# EAGLE design arduino modular pcb (EAGLE 9.6.2)
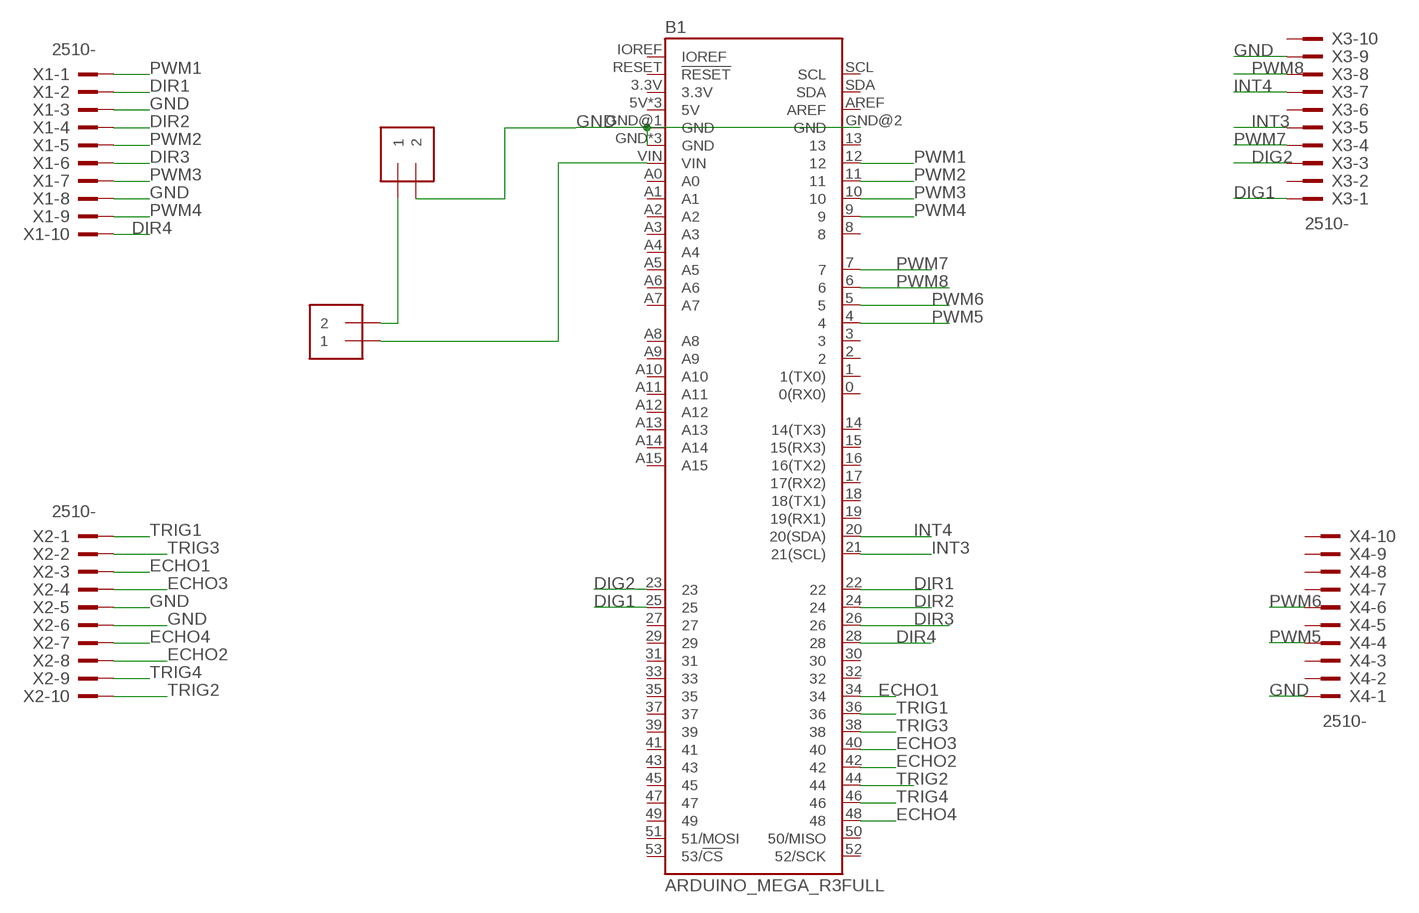
[diagram p0: schematic, sheet 1]

## Parts
B1  ARDUINO_MEGA_R3FULL  [ARDUINO_MEGA_NO_SILK]
J1  1X2-3.5MM  [1X2-3.5MM]
J2  1X2-3.5MM  [1X2-3.5MM]
X1  2510-  [PAK100/2500-10]
X2  2510-  [PAK100/2500-10]
X3  2510-  [PAK100/2500-10]
X4  2510-  [PAK100/2500-10]

## Nets
DIG1: B1.25 X3.1
DIG2: B1.23 X3.3
DIR1: B1.22 X1.2
DIR2: B1.24 X1.4
DIR3: B1.26 X1.6
DIR4: B1.28 X1.10
ECHO1: B1.34 X2.3
ECHO2: B1.42 X2.8
ECHO3: B1.40 X2.4
ECHO4: B1.48 X2.7
GND: B1.GND B1.GND@1(GND) B1.GND@2(GND) B1.GND@3(GND) B1.GND@4(GND) J2.2 X1.3 X1.8 X2.5 X2.6 X3.9 X4.1
INT3: B1.21(21(SCL)) X3.5
INT4: B1.20(20(SDA)) X3.7
N$1: J1.2 J2.1
N$3: B1.VIN J1.1
PWM1: B1.12 X1.1
PWM2: B1.11 X1.5
PWM3: B1.10 X1.7
PWM4: B1.9 X1.9
PWM5: B1.4 X4.4
PWM6: B1.5 X4.6
PWM7: B1.7 X3.4
PWM8: B1.6 X3.8
TRIG1: B1.36 X2.1
TRIG2: B1.44 X2.10
TRIG3: B1.38 X2.2
TRIG4: B1.46 X2.9
Unconnected: B1.0(0(RX0)) B1.1(1(TX0)) B1.2 B1.3 B1.3.3V B1.5V B1.5V@1(5V) B1.5V@2(5V) B1.8 B1.13 B1.14(14(TX3)) B1.15(15(RX3)) B1.16(16(TX2)) B1.17(17(RX2)) B1.18(18(TX1)) B1.19(19(RX1)) B1.27 B1.29 B1.30 B1.31 B1.32 B1.33 B1.35 B1.37 B1.39 B1.41 B1.43 B1.45 B1.47 B1.49 B1.50(50/MISO) B1.51(51/MOSI) B1.52(52/SCK) B1.53(53/!CS) B1.A0 B1.A1 B1.A2 B1.A3 B1.A4 B1.A5 B1.A6 B1.A7 B1.A8 B1.A9 B1.A10 B1.A11 B1.A12 B1.A13 B1.A14 B1.A15 B1.AREF B1.IOREF B1.RESET(!RESET) B1.SCL B1.SDA X3.2 X3.6 X3.10 X4.2 X4.3 X4.5 X4.7 X4.8 X4.9 X4.10

## Library data of the parts
B1 = SparkFun-Boards:ARDUINO_MEGA_R3: Arduino Mega R3 ATmega2560 R3 compatible footprint. SparkFun Products: Arduino Mega 2560 R3 <https://www.sparkfun.com/products/11061>
J1 J2 = adafruit:1X2: 3.5mm Terminal block http://www.ladyada.net/library/pcb/eaglelibrary.html
X1-X4 = con-3m:2510-: 3M (TM) Pak 100 4-Wall Header Source: 3M; MF: 3M; MPN: 2510-6002UB; OC_FARNELL: 9838244; OC_NEWARK: 46F4725

## Board
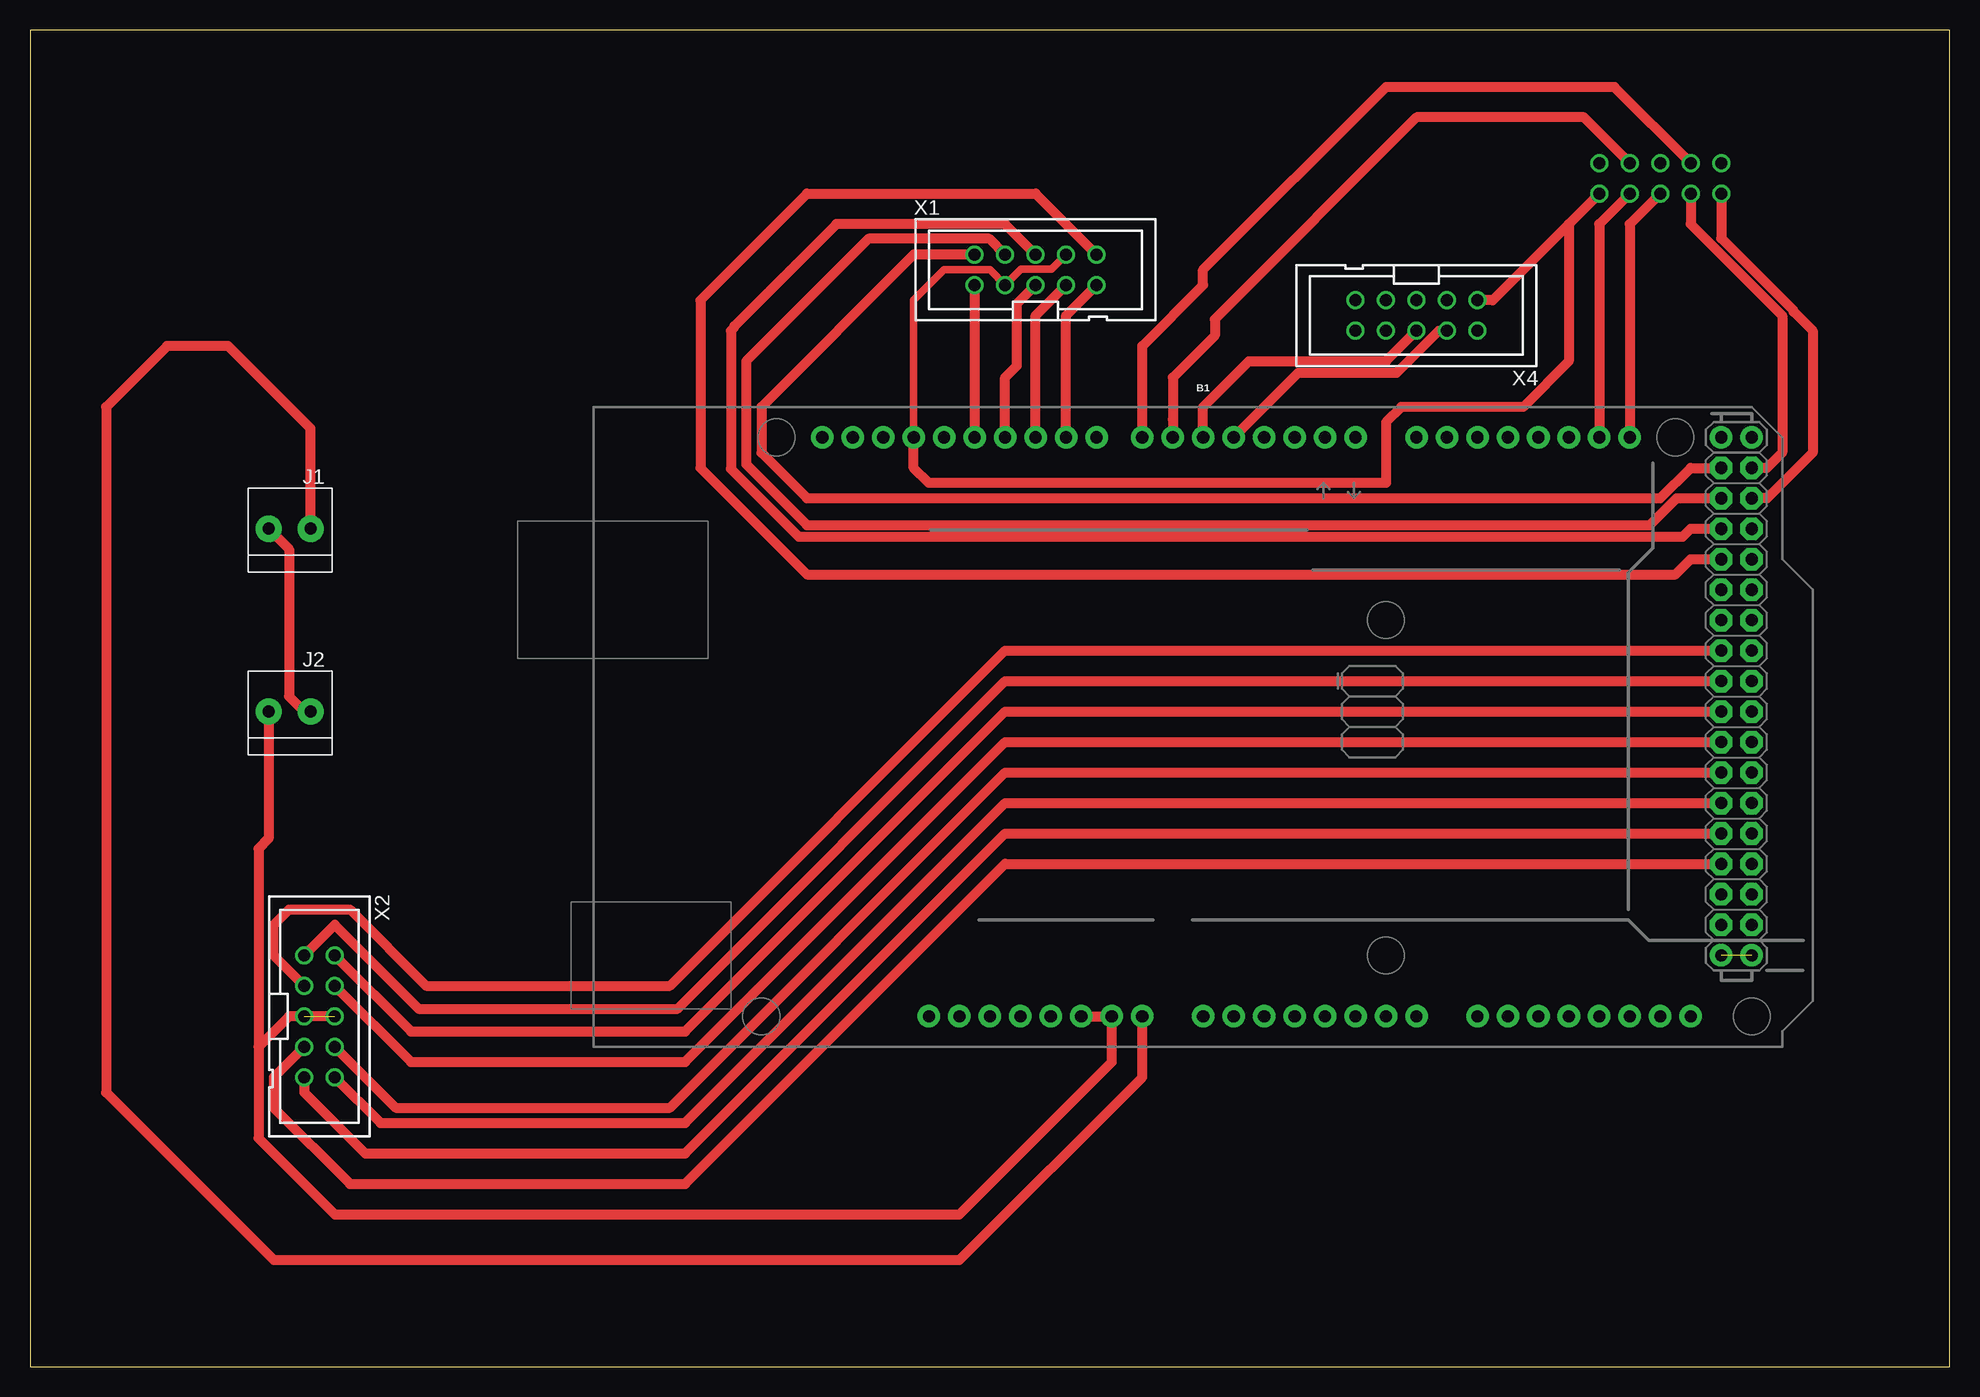
[diagram p1: board, top side]
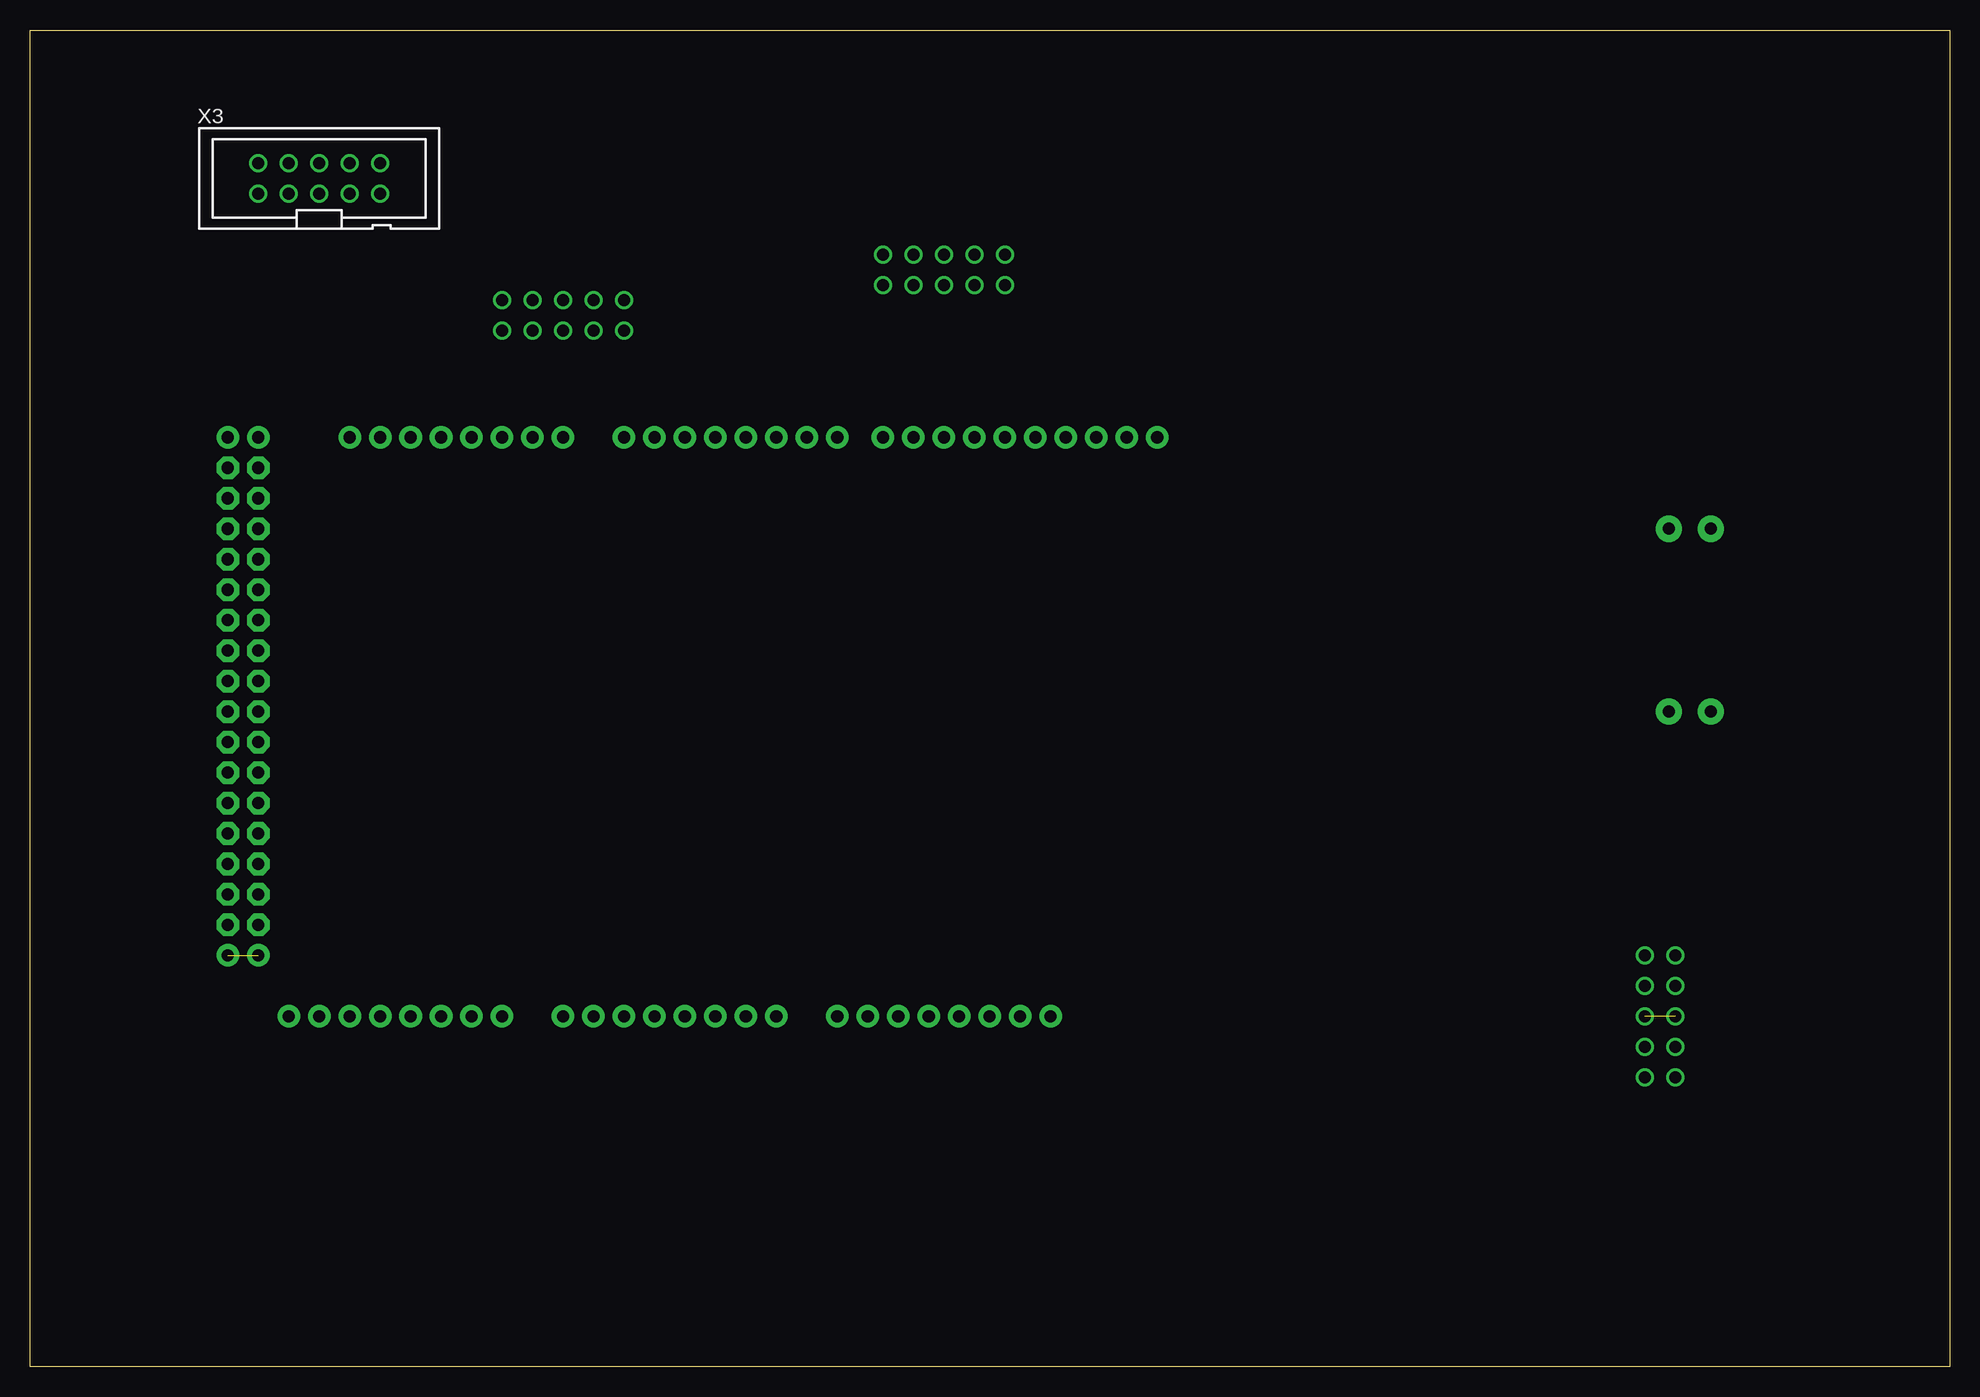
[diagram p2: board, bottom side, seen from below]

Size 160 x 111.43 mm. Coordinates in mm from the lower left corner, seen from the top.
Outline: 0,0 160,0 160,111.43 0,111.43 0,0
Copper layers (1*16): Top 0.035mm / dielectric 1.5mm / Bottom 0.035mm
Design rules "default": minimum track width 6mil, minimum drill 0.35mm, track to track 6mil, track to pad 6mil, pad to pad 6mil, via to via 6mil, smd to smd 6mil, copper to edge 40mil, drill to drill 6mil, minimum pad ring 10mil, minimum via ring 8mil, stop-mask expansion 4mil, vias tented up to drill 0mil, thermal gap 10mil

### Footprints (pad centres in the part's own frame; a part is rotated, then mirrored left to right if it is on the bottom)
ARDUINO_MEGA_NO_SILK = drill 1.016 pad 1.88: 0 13.97,24.13; 1 11.43,24.13; 2 8.89,24.13; 3 6.35,24.13; 3.3V -13.97,-24.13; 4 3.81,24.13; 5 1.27,24.13; 5V -11.43,-24.13; 5V@1 44.45,24.13; 5V@2 46.99,24.13; 6 -1.27,24.13; 7 -3.81,24.13; 8 -7.62,24.13; 9 -10.16,24.13; 10 -12.7,24.13; 11 -15.24,24.13; 12 -17.78,24.13; 13 -20.32,24.13; 14 19.05,24.13; 15 21.59,24.13; 16 24.13,24.13; 17 26.67,24.13; 18 29.21,24.13; 19 31.75,24.13; 20 34.29,24.13; 21 36.83,24.13; A0 1.27,-24.13; A1 3.81,-24.13; A2 6.35,-24.13; A3 8.89,-24.13; A4 11.43,-24.13; A5 13.97,-24.13; A6 16.51,-24.13; A7 19.05,-24.13; A8 24.13,-24.13; A9 26.67,-24.13; A10 29.21,-24.13; A11 31.75,-24.13; A12 34.29,-24.13; A13 36.83,-24.13; A14 39.37,-24.13; A15 41.91,-24.13; AREF -25.4,24.13; GND -8.89,-24.13; GND@1 -6.35,-24.13; GND@2 44.45,-19.05; GND@3 46.99,-19.05; GND@4 -22.86,24.13; IOREF -19.05,-24.13; NC -21.59,-24.13; RESET -16.51,-24.13; SCL -30.48,24.13; SDA -27.94,24.13; VIN -3.81,-24.13 | drill 1.016 pad 1.88 octagon: 22 44.45,21.59; 23 46.99,21.59; 24 44.45,19.05; 25 46.99,19.05; 26 44.45,16.51; 27 46.99,16.51; 28 44.45,13.97; 29 46.99,13.97; 30 44.45,11.43; 31 46.99,11.43; 32 44.45,8.89; 33 46.99,8.89; 34 44.45,6.35; 35 46.99,6.35; 36 44.45,3.81; 37 46.99,3.81; 38 44.45,1.27; 39 46.99,1.27; 40 44.45,-1.27; 41 46.99,-1.27; 42 44.45,-3.81; 43 46.99,-3.81; 44 44.45,-6.35; 45 46.99,-6.35; 46 44.45,-8.89; 47 46.99,-8.89; 48 44.45,-11.43; 49 46.99,-11.43; 50 44.45,-13.97; 51 46.99,-13.97; 52 44.45,-16.51; 53 46.99,-16.51
1X2-3.5MM = drill 1 pad 2.184: 1 1.8,0; 2 -1.7,0
PAK100/2500-10 = drill 1 pad 1.422: 1 -5.08,-1.27; 2 -5.08,1.27; 3 -2.54,-1.27; 4 -2.54,1.27; 5 0,-1.27; 6 0,1.27; 7 2.54,-1.27; 8 2.54,1.27; 9 5.08,-1.27; 10 5.08,1.27

### Placement (x,y rotation side)
B1  96.52,53.34 0 top
J1  21.59,69.85 0 top
J2  21.59,54.61 0 top
X1  83.82,91.44 0 top
X2  24.13,29.21 270 top
X3  135.89,99.06 0 bottom
X4  115.57,87.63 180 top

### Tracks (layer width: path | path; a pad name or v marks a point on that pad's centre or on a via)
DIG1
  Top 0.813: X3.1 140.97,94.08 147.01,88.03 147.01,87.94 148.59,86.36 148.59,76.2 145.01,72.62 144.78,72.39 B1.25
DIG2
  Top 0.813: X3.3 138.43,95.25 146.05,87.63 146.05,76.2 145.01,75.16 144.78,74.93 B1.23
DIR1
  Top 0.813: X1.2 73.66,92.71 60.96,80.01 60.96,76.2 64.77,72.39 135.89,72.39 138.43,74.93 B1.22
DIR2
  Top 0.813: B1.24 137.25,72.39 135.02,70.16 64.77,70.16 59.69,75.23 59.69,83.82 69.89,94.02 79.97,94.02 X1.4
DIR3
  Top 0.813: X1.6 81.28,95.25 67.22,95.25 58.73,86.76 58.73,86.67 58.42,86.36 58.42,74.83 64.06,69.19 137.77,69.19 138.43,69.85 B1.26
DIR4
  Top 0.813: B1.28 138.43,67.31 137.16,66.04 64.77,66.04 55.88,74.93 55.88,88.9 64.77,97.79 83.82,97.79 X1.10
ECHO1
  Top 0.813: X2.3 20.32,34.29 20.32,36.83 21.59,38.1 26.67,38.1 33.02,31.75 53.34,31.75 81.28,59.69 B1.34
ECHO2
  Top 0.813: X2.8 30.48,21.59 53.34,21.59 81.28,49.53 B1.42
ECHO3
  Top 0.813: X2.4 31.75,25.4 54.61,25.4 81.28,52.07 B1.40
ECHO4
  Top 0.813: X2.7 20.32,24.13 20.32,21.59 26.67,15.24 54.61,15.24 81.28,41.91 B1.48
GND  (2 unrouted)
  Top 0.61: B1.GND@4 73.66,88.9 76.2,91.44 80.01,91.44 X1.3 82.61,91.5 85.09,91.5 85.15,91.5 X1.8
  Top 0.813: X2.6 21.59,29.21 19.05,26.67 | 19.05,26.67 19.05,19.05 25.4,12.7 77.47,12.7 90.17,25.4 B1.GND@1 B1.GND | B1.GND@4 73.66,74.93 74.93,73.66 113.03,73.66 113.03,78.74 114.3,80.01 124.46,80.01 128.27,83.82 128.27,95.25 | X3.9 128.27,95.25 | 128.27,95.25 121.92,88.9 X4.1 | J2.2 19.89,44.02 19.05,43.18 19.05,26.67
INT3
  Top 0.813: X3.5 133.35,95.25 B1.21
INT4
  Top 0.813: X3.7 130.81,95.25 B1.20
N$1
  Top 0.813: J1.2 21.59,68.15 21.59,55.88 22.86,54.61 J2.1
N$3
  Top 0.813: J1.1 23.39,78.21 16.51,85.09 11.43,85.09 6.35,80.01 6.35,22.86 20.32,8.89 77.47,8.89 92.71,24.13 B1.VIN
PWM1
  Top 0.813: X1.1 B1.12
PWM2
  Top 0.813: X1.5 82.25,88.59 82.25,83.42 81.28,82.45 B1.11
PWM3
  Top 0.813: X1.7 83.82,87.63 B1.10
PWM4
  Top 0.813: X1.9 86.36,87.63 B1.9
PWM5
  Top 0.813: B1.4 105.72,82.86 113.92,82.86 117.43,86.36 X4.4
PWM6
  Top 0.813: B1.5 97.79,80.01 101.6,83.82 113.03,83.82 X4.6
PWM7
  Top 0.813: X3.4 132.08,106.68 113.03,106.68 97.79,91.44 97.79,90.17 92.71,85.09 B1.7
PWM8
  Top 0.813: X3.8 129.54,104.14 115.57,104.14 98.75,87.33 98.75,85.96 95.25,82.45 95.25,80.01 95.25,78.97 B1.6
TRIG1
  Top 0.813: X2.1 25.4,36.83 32.38,29.84 53.98,29.84 81.28,57.15 B1.36
TRIG2
  Top 0.813: X2.10 29.21,20.32 54.61,20.32 81.28,46.99 B1.44
TRIG3
  Top 0.813: X2.2 31.75,27.94 54.61,27.94 81.28,54.61 B1.38
TRIG4
  Top 0.813: X2.9 22.86,22.86 27.94,17.78 54.61,17.78 81.28,44.45 B1.46